# Altium schematic sheet Compute_Module_EXT_INTERFACES.SchDoc: STM32F446 CNC
size C; Author: AM; CompanyName: Expatria Technologies; DrawnBy: A.Marles; Engineer: AM; Organization: Expatria Technolgoies; Address1: 1136 Glade Court; Address3: Port Coquitlam, BC V3B 1R5; Address4: Canada; DocumentNumber: 8; SheetNumber: 8; SheetTotal: 30
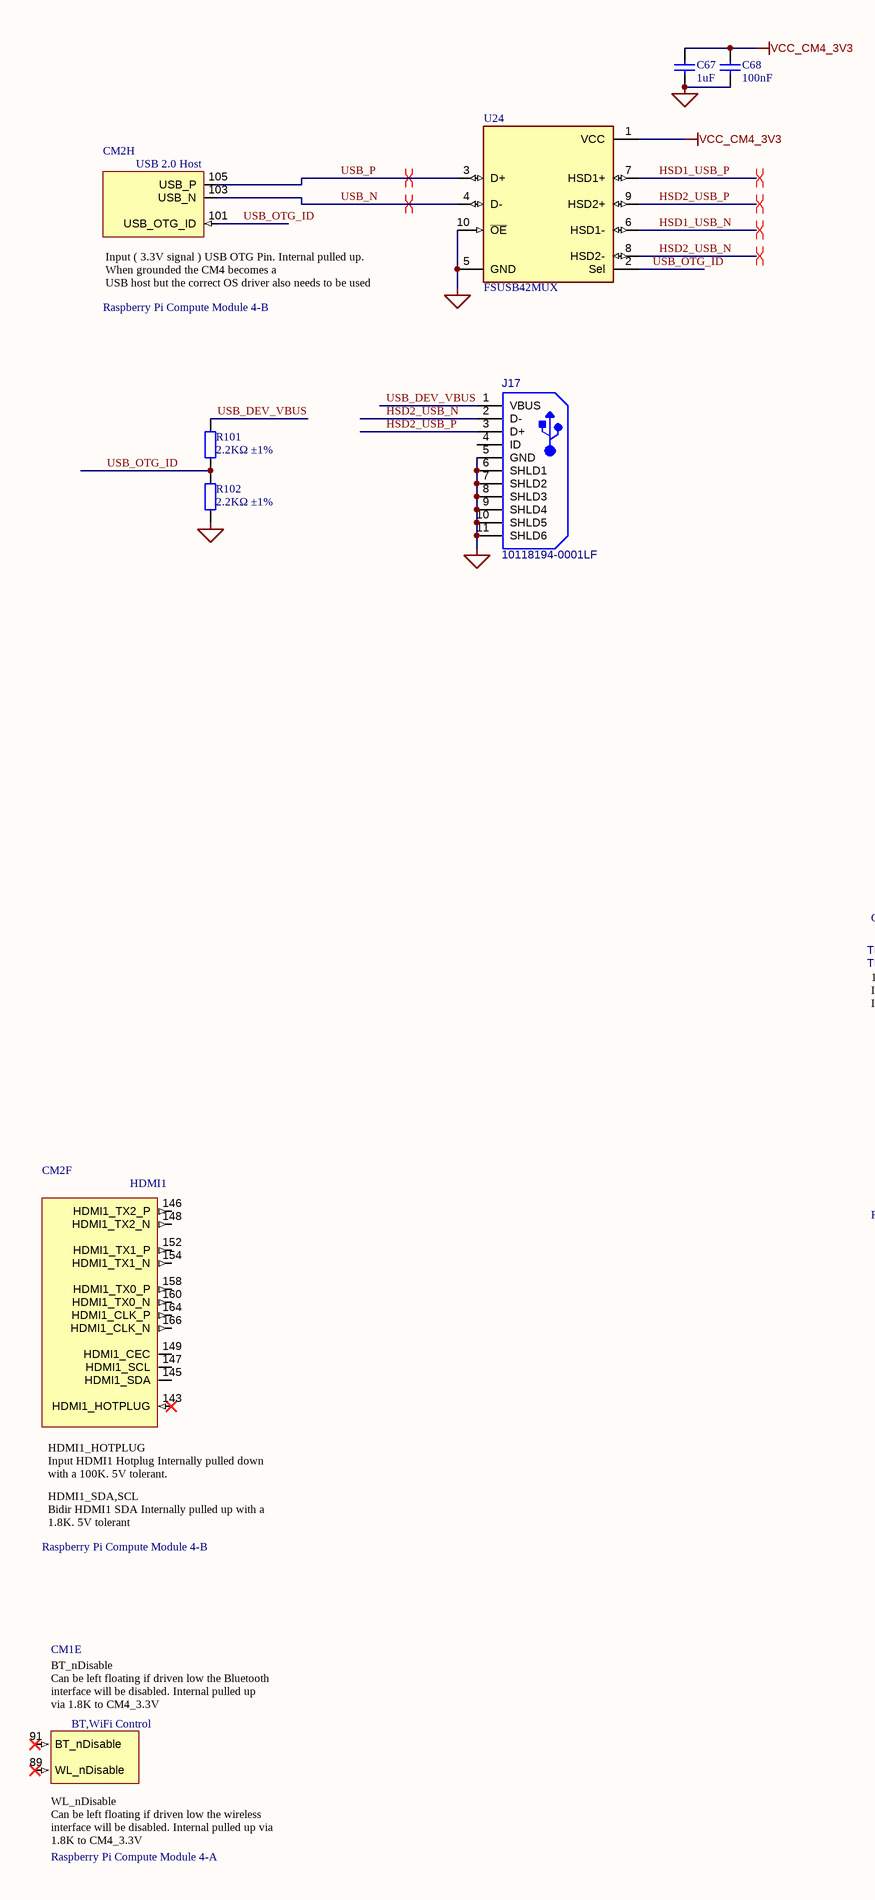
[diagram p0: Compute_Module_EXT_INTERFACES.SchDoc, left]
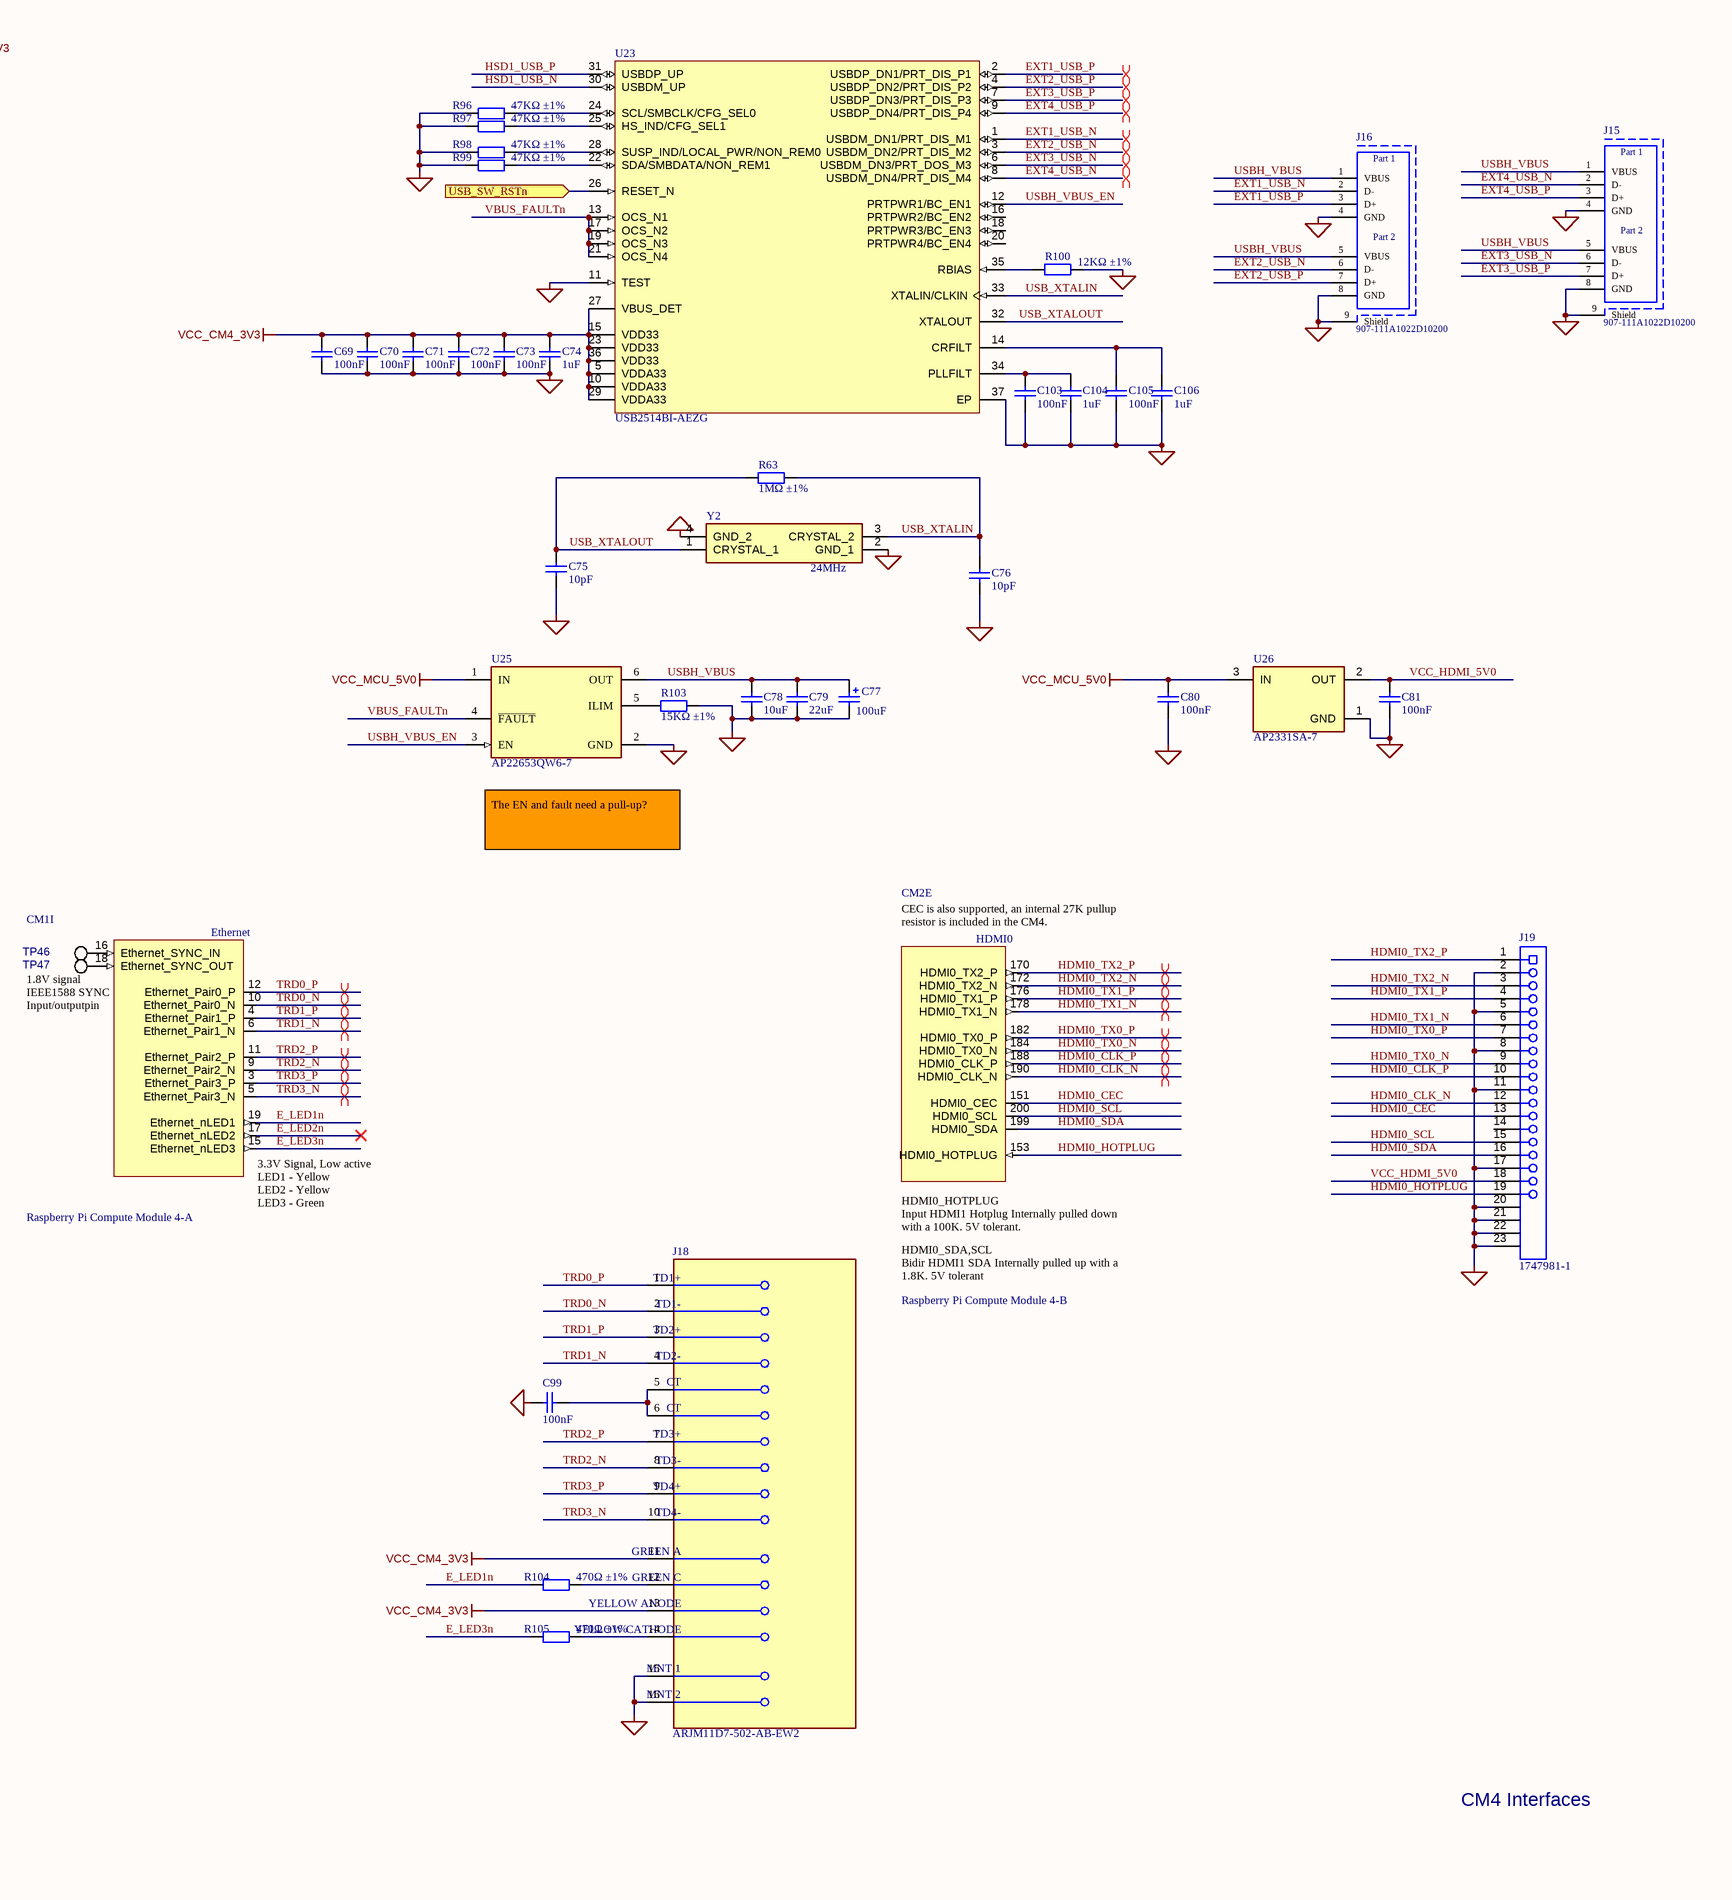
[diagram p1: Compute_Module_EXT_INTERFACES.SchDoc, right]

## Parts
C67  1uF  [0603_C]
C68  100nF  [0603_C]
C69  100nF  [0603_C]
C70  100nF  [0603_C]
C71  100nF  [0603_C]
C72  100nF  [0603_C]
C73  100nF  [0603_C]
C74  1uF  [0603_C]
C75  10pF  [0603_C]
C76  10pF  [0603_C]
C77  100uF  [WCAP-ASLI_D6.3H7.7]
C78  10uF  [1206_C]
C79  22uF  [0805_C]
C80  100nF  [0603_C]
C81  100nF  [0603_C]
C99  100nF  [0603_C]
C103  100nF  [0603_C]
C104  1uF  [0603_C]
C105  100nF  [0603_C]
C106  1uF  [0603_C]
CM1  Raspberry Pi Compute Module 4-A  [DF40HC30100DS04V51]  (parts E,I of 14)
CM2  Raspberry Pi Compute Module 4-B  [DF40HC30100DS04V51 - p101-200]  (parts E,F,H of 10)
J15  907-111A1022D10200  [USB-A-TH_USB-M-51]
J16  907-111A1022D10200  [USB-A-TH_USB-M-51]
J17  10118194-0001LF  [FCI-10118194-0001LF-5_V]
J18  ARJM11D7-502-AB-EW2  [FP-ARJM11D7-502-AB-EW2-MFG]
J19  1747981-1  [TE-1747981-1_V]
R63  1MΩ ±1%  [0402_R]
R96  47KΩ ±1%  [0402_R]
R97  47KΩ ±1%  [0402_R]
R98  47KΩ ±1%  [0402_R]
R99  47KΩ ±1%  [0402_R]
R100  12KΩ ±1%  [0402_R]
R101  2.2KΩ ±1%  [0402_R]
R102  2.2KΩ ±1%  [0402_R]
R103  15KΩ ±1%  [0402_R]
R104  470Ω ±1%  [0402_R]
R105  470Ω ±1%  [0402_R]
TP46  TESTPOINT  [TP/SMALL]  (value not drawn)  (no BOM)
TP47  TESTPOINT  [TP/SMALL]  (value not drawn)  (no BOM)
U23  USB2514BI-AEZG  [QFN50P600X600X100-37N-D]
U24  FSUSB42MUX  [SOP50P490X110-10N]
U25  AP22653QW6-7  [SOT95P280X145-6N]
U26  AP2331SA-7  [SOT91P240X120-3N]
Y2  value 24MHz  [YSX321SL]  (hidden comment: 24.0 MHz)

## Ports
USB_SW_RSTn (in)

## Nets
MCU_GND: C67.1 C68.1 C69.1 C70.1 C71.1 C72.1 C73.1 C74.1 C75.1 C76.1 C77.2(N) C78.1 C79.1 C80.1 C81.1 C99.2 C103.1 C104.1 C105.1 C106.1 J15.4(GND) J15.8(GND) J15.9(Shield) J16.4(GND) J16.8(GND) J16.9(Shield) J17.5(GND) J17.6(SHLD1) J17.7(SHLD2) J17.8(SHLD3) J17.9(SHLD4) J17.10(SHLD5) J17.11(SHLD6) J18.15(MNT_1) J18.16(MNT_2) J19.2 J19.5 J19.8 J19.11 J19.17 J19.20(SHLD1) J19.21(SHLD2) J19.22(SHLD3) J19.23(SHLD4) R96.2 R97.2 R98.2 R99.2 R100.2 R102.1 R103.2 U23.11(TEST) U23.37(EP) U24.5(GND) U24.10(~{OE}) U25.2(GND) U26.1(GND) Y2.2(GND_1) Y2.4(GND_2)
VCC_CM4_3V3: C67.2 C68.2 C69.2 C70.2 C71.2 C72.2 C73.2 C74.2 J18.11(GREEN_A) J18.13(YELLOW_ANODE) U23.5(VDDA33) U23.10(VDDA33) U23.15(VDD33) U23.23(VDD33) U23.27(VBUS_DET) U23.29(VDDA33) U23.36(VDD33) U24.1(VCC)
VCC_MCU_5V0: C80.2 U25.1(IN) U26.3(IN)
E_LED1n: CM1.19(Ethernet_nLED1) R104.1
E_LED2n: CM1.17(Ethernet_nLED2)
E_LED3n: CM1.15(Ethernet_nLED3) R105.1
EXT1_USB_N: J16.2(D-) U23.1(USBDM_DN1/PRT_DIS_M1)
EXT1_USB_P: J16.3(D+) U23.2(USBDP_DN1/PRT_DIS_P1)
EXT2_USB_N: J16.6(D-) U23.3(USBDM_DN2/PRT_DIS_M2)
EXT2_USB_P: J16.7(D+) U23.4(USBDP_DN2/PRT_DIS_P2)
EXT3_USB_N: J15.6(D-) U23.6(USBDM_DN3/PRT_DOS_M3)
EXT3_USB_P: J15.7(D+) U23.7(USBDP_DN3/PRT_DIS_P3)
EXT4_USB_N: J15.2(D-) U23.8(USBDM_DN4/PRT_DIS_M4)
EXT4_USB_P: J15.3(D+) U23.9(USBDP_DN4/PRT_DIS_P4)
HDMI0_CEC: CM2.151(HDMI0_CEC) J19.13
HDMI0_CLK_N: CM2.190(HDMI0_CLK_N) J19.12
HDMI0_CLK_P: CM2.188(HDMI0_CLK_P) J19.10
HDMI0_HOTPLUG: CM2.153(HDMI0_HOTPLUG) J19.19
HDMI0_SCL: CM2.200(HDMI0_SCL) J19.15
HDMI0_SDA: CM2.199(HDMI0_SDA) J19.16
HDMI0_TX0_N: CM2.184(HDMI0_TX0_N) J19.9
HDMI0_TX0_P: CM2.182(HDMI0_TX0_P) J19.7
HDMI0_TX1_N: CM2.178(HDMI0_TX1_N) J19.6
HDMI0_TX1_P: CM2.176(HDMI0_TX1_P) J19.4
HDMI0_TX2_N: CM2.172(HDMI0_TX2_N) J19.3
HDMI0_TX2_P: CM2.170(HDMI0_TX2_P) J19.1
HSD1_USB_N: U23.30(USBDM_UP) U24.6(HSD1-)
HSD1_USB_P: U23.31(USBDP_UP) U24.7(HSD1+)
HSD2_USB_N: J17.2(D-) U24.8(HSD2-)
HSD2_USB_P: J17.3(D+) U24.9(HSD2+)
TRD0_N: CM1.10(Ethernet_Pair0_N) J18.2(TD1-)
TRD0_P: CM1.12(Ethernet_Pair0_P) J18.1(TD1+)
TRD1_N: CM1.6(Ethernet_Pair1_N) J18.4(TD2-)
TRD1_P: CM1.4(Ethernet_Pair1_P) J18.3(TD2+)
TRD2_N: CM1.9(Ethernet_Pair2_N) J18.8(TD3-)
TRD2_P: CM1.11(Ethernet_Pair2_P) J18.7(TD3+)
TRD3_N: CM1.5(Ethernet_Pair3_N) J18.10(TD4-)
TRD3_P: CM1.3(Ethernet_Pair3_P) J18.9(TD4+)
USB_DEV_VBUS: J17.1(VBUS) R101.2
USB_N: CM2.103(USB_N) U24.4(D-)
USB_OTG_ID: CM2.101(USB_OTG_ID) R101.1 R102.2 U24.2(Sel)
USB_P: CM2.105(USB_P) U24.3(D+)
USB_SW_RSTn: U23.26(RESET_N) ; port USB_SW_RSTn
USB_XTALIN: C76.2 R63.2 U23.33(XTALIN/CLKIN) Y2.3(CRYSTAL_2)
USB_XTALOUT: C75.2 R63.1 U23.32(XTALOUT) Y2.1(CRYSTAL_1)
USBH_VBUS: C77.1(P) C78.2 C79.2 J15.1(VBUS) J15.5(VBUS) J16.1(VBUS) J16.5(VBUS) U25.6(OUT)
USBH_VBUS_EN: U23.12(PRTPWR1/BC_EN1) U25.3(EN)
VBUS_FAULTn: U23.13(OCS_N1) U23.17(OCS_N2) U23.19(OCS_N3) U23.21(OCS_N4) U25.4(~{FAULT})
VCC_HDMI_5V0: C81.2 J19.18 U26.2(OUT)
NetC99_1: C99.1 J18.5(CT) J18.6(CT)
NetC103_2: C103.2 C104.2 U23.34(PLLFILT)
NetC105_2: C105.2 C106.2 U23.14(CRFILT)
NetCM1_16: CM1.16(Ethernet_SYNC_IN) TP46.1
NetCM1_18: CM1.18(Ethernet_SYNC_OUT) TP47.1
NetJ18_12: J18.12(GREEN_C) R104.2
NetJ18_14: J18.14(YELLOW_CATHODE) R105.2
NetR96_1: R96.1 U23.24(SCL/SMBCLK/CFG_SEL0)
NetR97_1: R97.1 U23.25(HS_IND/CFG_SEL1)
NetR98_1: R98.1 U23.28(SUSP_IND/LOCAL_PWR/NON_REM0)
NetR99_1: R99.1 U23.22(SDA/SMBDATA/NON_REM1)
NetR100_1: R100.1 U23.35(RBIAS)
NetR103_1: R103.1 U25.5(ILIM)

Not connected (* = marked no-connect by the designer): CM1 89(WL_nDisable)* 91(BT_nDisable)*; CM2 143(HDMI1_HOTPLUG)* 145(HDMI1_SDA) 146(HDMI1_TX2_P) 147(HDMI1_SCL) 148(HDMI1_TX2_N) 149(HDMI1_CEC) 152(HDMI1_TX1_P) 154(HDMI1_TX1_N) 158(HDMI1_TX0_P) 160(HDMI1_TX0_N) 164(HDMI1_CLK_P) 166(HDMI1_CLK_N); J17 4(ID); J19 14; U23 16(PRTPWR2/BC_EN2) 18(PRTPWR3/BC_EN3) 20(PRTPWR4/BC_EN4)

## Layout directives
differential pair: EXT1_USB_N, EXT1_USB_P, EXT2_USB_N, EXT2_USB_P, EXT3_USB_N, EXT3_USB_P, EXT4_USB_N, EXT4_USB_P, HDMI0_CLK_N, HDMI0_CLK_P, HDMI0_TX0_N, HDMI0_TX0_P, HDMI0_TX1_N, HDMI0_TX1_P, HDMI0_TX2_N, HDMI0_TX2_P, HSD1_USB_N, HSD1_USB_P, HSD2_USB_N, HSD2_USB_P, TRD0_N, TRD0_P, TRD1_N, TRD1_P, TRD2_N, TRD2_P, TRD3_N, TRD3_P, USB_N, USB_P

## Notes on the sheet
- (near U25) The EN and fault need a pull-up?
- CM4 Interfaces
- SHEET
- PROJECT
- REV
- Expatria Technologies
- 1136 Glade Court
- Port Coquitlam, BC V3B 1R5
- PHONE: (778) 238-9336
- EMAIL: info@expatria.ca
- SIZE
- ENGR
- C
- MODIFIED
- DOCUMENT
- /
- Copyright Expatria Technologies 2022. This document describes Open Hardware and is licensed under the CERN-OHL-S v2. No warranty is implied or expressed.
- (in symbol 907-111A1022D10200) Part 1; Part 2
- (in symbol CM4_Module_A, part E) BT_nDisable / Can be left floating if driven low the Bluetooth interface will be disabled. Internal pulled up / via 1.8K to CM4_3.3V; BT,WiFi Control; WL_nDisable / Can be left floating if driven low the wireless interface will be disabled. Internal pulled up via / 1.8K to CM4_3.3V
- (in symbol CM4_Module_A, part I) Ethernet; 1.8V signal / IEEE1588 SYNC Input/outputpin; by Amornthep Phunsin; 3.3V Signal, Low active / LED1 - Yellow / LED2 - Yellow / LED3 - Green
- (in symbol CM4_Module_B, part E) HDMI0; CEC is also supported, an internal 27K pullup resistor is included in the CM4.; HDMI0_HOTPLUG / Input HDMI1 Hotplug Internally pulled down with a 100K. 5V tolerant.; HDMI0_SDA,SCL / Bidir HDMI1 SDA Internally pulled up with a 1.8K. 5V tolerant
- (in symbol CM4_Module_B, part F) HDMI1; HDMI1_HOTPLUG / Input HDMI1 Hotplug Internally pulled down with a 100K. 5V tolerant.; HDMI1_SDA,SCL / Bidir HDMI1 SDA Internally pulled up with a 1.8K. 5V tolerant
- (in symbol CM4_Module_B, part H) USB 2.0 Host; Input ( 3.3V signal ) USB OTG Pin. Internal pulled up. When grounded the CM4 becomes a / USB host but the correct OS driver also needs to be used

## Library data of the parts
C67 C74 C104 C106 = 0603 1uF (105) 10% 50V: Chip capacitors; Manufacturer: Samsung Electro-Mechanics; Manufacturer Part Number: CL10A105KB8NNNC; Tolerance: 10%; Voltage: 50V; ComponentLink1Description: Supplier link; ComponentLink1URL: http://www.szlcsc.com/product/details_16531.html; Package: 0603; Supplier: LCSC; SuppliersPartNumber: C15849; Capacitance: 1uF
C68-C73 C80 C81 C99 C103 C105 = 0603 100nF (104) 10% 50V: Chip capacitors; Manufacturer: YAGEO; Manufacturer Part Number: CC0603KRX7R9BB104; Tolerance: 10%; Voltage: 50V; ComponentLink1Description: Supplier link; ComponentLink1URL: http://www.szlcsc.com/product/details_15331.html; Package: 0603; Supplier: LCSC; SuppliersPartNumber: C14663; Capacitance: 100nF
C75 C76 = 0603 10pF (100) 5% 50V: Chip capacitors; Manufacturer: Samsung Electro-Mechanics; PartNumber: CL10C100JB8NNNC; Tolerance: 5%; Voltage: 50V; ComponentLink1Description: Supplier link; ComponentLink1URL: http://www.szlcsc.com/product/details_1986.html; Package: 0603; Supplier: LCSC; SuppliersPartNumber: C1634; Capacitance: 10pF; Manufacturer Part Number: CL10C100JB8NNNC
C77 = 865080445010: -45℃~+105℃ 2000hrs@105℃ 100uF 7.7mm 35V 6.3mm ±20% SMD,6.3x7.7mm Aluminum Electrolytic Capacitors - SMD ROHS; Manufacturer: Capxon International Elec; Manufacturer Part Number: HV101M035E077ETR; SuppliersPartNumber: C59934; Value: 100uF; Supplier: LCSC
C78 = 1206 10uF (106) 10% 50V: Chip capacitors; Manufacturer: Samsung Electro-Mechanics; Manufacturer Part Number: CL31A106KBHNNNE; Tolerance: 10%; Voltage: 50V; ComponentLink1Description: Supplier link; ComponentLink1URL: http://www.szlcsc.com/product/details_14236.html; Package: 1206; Supplier: LCSC; SuppliersPartNumber: C13585; Capacitance: 10uF; Manufacturer 1: Samsung Electro-Mechanics
C79 = 0805 22uF (226) 20% 25V: Chip capacitors; Manufacturer: Samsung Electro-Mechanics; PartNumber: CL21A226MAQNNNE; Tolerance: 20%; Voltage: 25V; ComponentLink1Description: Supplier link; ComponentLink1URL: http://www.szlcsc.com/product/details_46786.html; Package: 0805; Supplier: LCSC; SuppliersPartNumber: C45783; Capacitance: 22uF; Manufacturer Part Number: CL21A226MAQNNNE
CM1 = CM4_Module_A: Raspberry Pi Compute Module 4 Pins 1-100 (Connector A); Manufacturer: Hirose; Manufacturer Part Number: DF40HC(3.0)-100DS-0.4V(51); SuppliersPartNumber: C424649; Supplier: LCSC; Value: CM4_Module_A
CM2 = CM4_Module_B: Raspberry Pi Compute Module 4 Pins 101-200 (Connector B); Manufacturer: Hirose; Manufacturer Part Number: DF40HC(3.0)-100DS-0.4V(51); SuppliersPartNumber: C424649; Supplier: LCSC; Value: CM4_Module_B
J15 J16 = 907-111A1022D10200: USB 2.0 2 8 Female Type-A Plugin USB Connectors ROHS; Manufacturer: Jing Extension of the Electronic Co.; SuppliersPartNumber: C12049; Supplier 1: LCSC; Supplier Part Number 1: C12049; Manufacturer Part Number: 907-111A1022D10200; RoHS: No; Supplier: LCSC
J17 = USB-5-6SHLD: CONN RCPT USB2.0 MICRO B SMD R/A; Manufacturer 1: Amphenol ICC (FCI); Connector Type: Receptacle,USB; Manufacturer Part Number 1: 10118194-0001LF; Supplier: LCSC; Supplier Part Number 1: C132563; Manufacturer Part Number: 10118194-0001LF; SuppliersPartNumber: C132563; Value: 10118194-0001LF; Manufacturer: Amphenol ICC (FCI)
J18 = ARJM11D7-502-AB-EW2: 1 Port RJ45Through Hole 10/100/1000 Base-T, AutoMDIX; Manufacturer: Abracon LLC; Number of Ports: 1; Connector Type: RJ45; Shielding: Shielded; Direction: Up; Number of Cores per Jack: 8; Value: ARJM11D7-502-AB-EW2; SuppliersPartNumber: 535-14152-ND; Supplier: Digi-Key; Manufacturer Part Number: ARJM11D7-502-AB-EW2; Max Operating Temperature: 85°C; Min Operating Temperature: -40°C; Contact Plating: Gold; RoHS Compliant: Yes; Termination: Solder; Mount: Through Hole; Color: Green; Number of Rows: 1; Packaging: Tray
J19 = CMP-1684-00008-1: HDMI Receptacle, Pitch 0.5 mm, 19 Position, Height 6.38 mm, RoHS, Tape and Reel; Manufacturer: TE Connectivity; Power Rating: 100 mW; Tolerance: 1%; Resistance: 3.6 kohm; Voltage Rating: 50 V; Packaging: Tape and Reel; Max Operating Temperature: 155degC; RoHSCompliant: True; Case/Package: 0603; Mount: Surface Mount; ComponentLink2URL: http://www.te.com/commerce/DocumentDelivery/DDEController?Action=showdoc&DocId=Customer+Drawing%7F1747981%7FF5%7Fpdf%7FEnglish%7FENG_CD_1747981_F5.pdf%7F1747981-1; Length: 1.6 mm; ComponentLink2Description: Datasheet; ComponentLink1Description: Manufacturer URL; PackageReference: 1747981-1; Package Quantity: 5000; Min Operating Temperature: -55degC; ComponentLink1URL: http://www.te.com/; REACH SVHC: Unknown; Case Code (Imperial): 0603; Height: 0.45 mm; Width: 0.8 mm; DatasheetVersion: Rev. F5, 12/2015; PackageDescription: HDMI Receptacle, Pitch 0.5 mm, 19 Position, Height 6.38 mm; Case Code (Metric): 1608; SuppliersPartNumber: C428484; Supplier: LCSC; Manufacturer Part Number: 1747981-1
R63 = 0402 1M (1004) 1%: Chip resistor; Manufacturer: Uniroyal Elec; PartNumber: 0402WGF1004TCE; Power: 1/16W; ComponentLink1Description: Supplier link; ComponentLink1URL: http://www.szlcsc.com/product/details_26826.html; Package: 0402; Supplier: LC; SuppliersPartNumber: C26083; Resistance: 1MΩ; Tolerance: 1%
R96-R99 = 0402 47K (4702) 1%: Chip resistor; Manufacturer: Uniroyal Elec; PartNumber: 0402WGF4702TCE; Power: 1/16W; ComponentLink1Description: Supplier link; ComponentLink1URL: http://www.szlcsc.com/product/details_26535.html; Package: 0402; Supplier: LCSC; SuppliersPartNumber: C25792; Resistance: 47KΩ; Tolerance: 1%; Manufacturer Part Number: 0402WGF4702TCE
R100 = 0402 12K (1202) 1%: Chip resistor; Manufacturer: Uniroyal Elec; PartNumber: 0402WGF1202TCE; Power: 1/16W; ComponentLink1Description: Supplier link; ComponentLink1URL: http://www.szlcsc.com/product/details_26495.html; Package: 0402; Supplier: LCSC; SuppliersPartNumber: C25752; Resistance: 12KΩ; Tolerance: 1%; Manufacturer Part Number: 0402WGF1202TCE
R101 R102 = 0402 2.2K (2201) 1%: Chip resistor; Manufacturer: Uniroyal Elec; PartNumber: 0402WGF2201TCE; Power: 1/16W; ComponentLink1Description: Supplier link; ComponentLink1URL: http://www.szlcsc.com/product/details_26622.html; Package: 0402; Supplier: LCSC; SuppliersPartNumber: C25879; Resistance: 2.2KΩ; Tolerance: 1%; Manufacturer Part Number: 0402WGF2201TCE
R103 = 0402 15K (1502) 1%: Chip resistor; Manufacturer: Uniroyal Elec; PartNumber: 0402WGF1502TCE; Power: 1/16W; ComponentLink1Description: Supplier link; ComponentLink1URL: http://www.szlcsc.com/product/details_26499.html; Package: 0402; Supplier: LCSC; SuppliersPartNumber: C25756; Resistance: 15KΩ; Tolerance: 1%; Manufacturer Part Number: 0402WGF1502TCE
R104 R105 = 0402 470R (4700) 1%: Chip resistor; Manufacturer: Uniroyal Elec; PartNumber: 0402WGF4700TCE; Power: 1/16W; ComponentLink1Description: Supplier link; ComponentLink1URL: http://www.szlcsc.com/product/details_25860.html; Package: 0402; Supplier: LCSC; SuppliersPartNumber: C25117; Resistance: 470Ω; Tolerance: 1%; Manufacturer Part Number: 0402WGF4700TCE
TP46 TP47 = TESTPOINT: Test Point; Manufacturer 1: N/A; Manufacturer Part Number 1: N/A; Value: Testpoint
U23 = USB2514BI-AEZG: Microchip USB2514BI-AEZG; USB Controller; 480Mbit/s; USB 2.0; 3.3 V; 36-Pin QFN; Current - Supply: 85mA; Standards: USB2.0; Auxiliary Sense: -40degC~85degC; Other Names: Q5138631 / Q5487824 / Q7033177 / USB2514BIAEZG; Voltage - Supply: 3V~3.6V; Dynamic Catalog: USBControllers; Function: HubController; Operating Supply Voltage: 3.3V; Data Rate: 480Mbps; Min Supply Voltage: 3V; Max Supply Voltage: 3.6V; Number of Ports: 4; Number of Transceivers: 1; ESD Protection: Yes; Family: Interface-Controllers; Datasheet Version: Rev. 2.2, 02/2012; Quantity Available: Tube; Type: USB; Supplier Device Package: 36-QFN-EP(6x6); Operating Temperature: -40degC~85degC; Manufacturer URL: http://www.microchip.com/; Packaging: Tube; Interface: USB; Protocol: USB; Package / Case: 36-TQFNExposedPad; Datasheet URL: https://datasheet.ciiva.com/22650/1691496-22650784.pdf; Standard Package: 490; Minimum Quantity: USB; Category: IntegratedCircuits(ICs); Manufacturer: Microchip; Internal Switch(s): 3V~3.6V; Manufacturer Part Number: USB2514BI-AEZG; Supplier 1: LCSC; Supplier Part Number 1: C633339; RoHS: Yes; Mount: Surface Mount; Case/Package: QFN; Number of Pins: 36; Contact Plating: Tin,Matte; Min Operating Temperature: -40°C; Max Operating Temperature: 85°C; Package Quantity: 490; Series: -; Operating Supply Current: 85mA; Length: 6.15mm; Width: 6.15mm; Height: 0.95mm; Radiation Hardening: No; Lead Free: Lead Free; RoHS Compliant: Yes; Reach SVHC Compliant: Yes; ComponentLink1URL: https://datasheet.ciiva.com/22650/1691496-22650784.pdf?src-supplier=Element14; ComponentLink1Description: https://datasheet.ciiva.com/22650/1691496-22650784.pdf?src-supplier=Element14; SuppliersPartNumber: C633339; Supplier: LCSC
U24 = FSUSB42MUX: FSUSB42 Series DPDT 4.3 V 480 Mbps SMT Hi Speed USB 2.0 Switch - MSOP-10; Manufacturer: ON Semiconductor / Fairchild; Voltage: 4.3V; Current: 100mA; Number of Inputs: 2; Supply Type: Single; Number of Outputs: 4; On-State Resistance: 6.5R; Min Supply Voltage: 3V; -3db Bandwidth: 720MHz; Package Quantity: 1; Length: 3mm; Radiation Hardening: No; Number of Pins: 10; Width: 3mm; Number of Channels: 2; REACH SVHC: No SVHC; Lead Free: Lead Free; Max Operating Temperature: 85°C; Min Operating Temperature: -40°C; Packaging: Tape and Reel; Throw Configuration: DPDT; Operating Supply Voltage: 4.3V; Max Supply Voltage: 4.3V; Data Rate: 480Mbps; Mount: Surface Mount; Case/Package: MSOP; Weight: 0.1125g; Height: 0.85mm; Manufacturer Part Number: FSUSB42MUX; Supplier 1: LCSC; Supplier Part Number 1: C11355; RoHS: Yes; Category: Interface ICs; Stock 1: 2967; Pricing 1: 1=0.493200, 10=0.493200, 30=0.463000, 32=0.458400, 34=0.458400, 36=0.458400 (AUD); Series: -; Reach SVHC Compliant: Yes; RoHS Compliant: Yes; ComponentLink1URL: https://datasheet.ciiva.com/1666/fsusb42-1666347.pdf?src-supplier=Digi-Key; ComponentLink1Description: https://datasheet.ciiva.com/1666/fsusb42-1666347.pdf?src-supplier=Digi-Key; ComponentLink2URL: https://datasheet.ciiva.com/1666/fsusb42-1666348.pdf?src-supplier=Digi-Key; ComponentLink2Description: https://datasheet.ciiva.com/1666/fsusb42-1666348.pdf?src-supplier=Digi-Key; ComponentLink3URL: https://datasheet.ciiva.com/1666/fsusb42-1666349.pdf?src-supplier=Digi-Key; ComponentLink3Description: https://datasheet.ciiva.com/1666/fsusb42-1666349.pdf?src-supplier=Digi-Key; ComponentLink4URL: https://datasheet.ciiva.com/3232/fsusb42-3232662.pdf?src-supplier=Avnet; ComponentLink4Description: https://datasheet.ciiva.com/3232/fsusb42-3232662.pdf?src-supplier=Avnet; ComponentLink5URL: https://datasheet.ciiva.com/3233/fsusb42-3233258.pdf?src-supplier=Avnet; ComponentLink5Description: https://datasheet.ciiva.com/3233/fsusb42-3233258.pdf?src-supplier=Avnet; ComponentLink6URL: https://datasheet.ciiva.com/4924/fsusb42-112719-4924269.pdf?src-supplier=Mouser; ComponentLink6Description: https://datasheet.ciiva.com/4924/fsusb42-112719-4924269.pdf?src-supplier=Mouser; Supplier: LCSC; SuppliersPartNumber: C11355
U25 = AP22653QW6-7: ESDA Series 14.2 V 90 pF Automotive Dual Transil ESD Array - SOT-23; Manufacturer: Diodes; Direction: Unidirectional,Bidirectional; Capacitance: 90pF; Number of Unidirectional Channels: 2; Reverse Standoff Voltage: 12V; Min Breakdown Voltage: 14.2V; Clamping Voltage: 21V; Peak Pulse Power: 300W; Power Line Protection: No; Leakage Current: 5uA; Operating Supply Voltage: 1.25V; Peak Pulse Current: 14A; Diode Type: ZENER; Manufacturer Part Number: AP22653QW6-7; Supplier 1: LCSC; Supplier Part Number 1: C5157828; RoHS: Yes; Category: TVS Diodes; Mount: Surface Mount; Number of Pins: 3; Min Operating Temperature: -40°C; Max Operating Temperature: 150°C; Packaging: Tape and Reel; Package Quantity: 3000; Working Voltage: 12V; Element Configuration: Dual; Resistor Type: Zener; Series: Automotive, AEC-Q101, ESDAY, TRANSIL™; Length: 2.9mm; Depth: 1.3mm; Radiation Hardening: No; Reach SVHC Compliant: Yes; RoHS Compliant: Yes; ComponentLink1URL: https://datasheet.ciiva.com/6574/dm00035279-6574399.pdf?src-supplier=Digi-Key; ComponentLink1Description: https://datasheet.ciiva.com/6574/dm00035279-6574399.pdf?src-supplier=Digi-Key; ComponentLink2URL: https://datasheet.ciiva.com/6574/dm00035279-6574410.pdf?src-supplier=Digi-Key; ComponentLink2Description: https://datasheet.ciiva.com/6574/dm00035279-6574410.pdf?src-supplier=Digi-Key; ComponentLink3URL: https://datasheet.ciiva.com/15186/getdatasheetpartid-491433-15186605.pdf?src-supplier=Verical; ComponentLink3Description: https://datasheet.ciiva.com/15186/getdatasheetpartid-491433-15186605.pdf?src-supplier=Verical; ComponentLink4URL: https://datasheet.ciiva.com/41443/001183987-da-01-en-tvs-diode-12v-2-esda14v2ly-sot-23-3l-stm-41443398.pdf?src-supplier=Conrad; ComponentLink4Description: https://datasheet.ciiva.com/41443/001183987-da-01-en-tvs-diode-12v-2-esda14v2ly-sot-23-3l-stm-41443398.pdf?src-supplier=Conrad; Supplier: LCSC; SuppliersPartNumber: C5157828; Case/Package: SOT-23
U26 = AP2331SA-7: AP2331 Series Single Channel 0.2 A Current-Limited Load Switch - SOT-23; Manufacturer: Diodes; Min Supply Voltage: 2.7V; Turn-On Delay Time: 700us; Output Current: 200mA; Max Supply Voltage: 5.2V; Number of Outputs: 1; On-State Resistance: 350mR; Min Operating Temperature: -40°C; Number of Pins: 3; Max Operating Temperature: 85°C; Height: 1.1mm; Package Quantity: 3000; Radiation Hardening: No; Case/Package: SOT-23; Width: 1.4mm; Mount: Surface Mount; Packaging: Tape and Reel; Length: 3mm; Supplier 1: LCSC; Supplier Part Number 1: C500764; Manufacturer Part Number: AP2331SA-7; RoHS: Yes; Category: Hot Swap Controllers; Weight: 0.00031oz; Max Input Voltage: 5.2V; Min Input Voltage: 2.7V; Series: -; Number of Switches: 1; Lead Free: Lead Free; Reach SVHC Compliant: Yes; RoHS Compliant: Yes; ComponentLink1URL: https://datasheet.ciiva.com/8142/ap2331-8142774.pdf?src-supplier=Avnet; ComponentLink1Description: https://datasheet.ciiva.com/8142/ap2331-8142774.pdf?src-supplier=Avnet; ComponentLink2URL: https://datasheet.ciiva.com/4923/ap2331-6844-4923636.pdf?src-supplier=Mouser; ComponentLink2Description: https://datasheet.ciiva.com/4923/ap2331-6844-4923636.pdf?src-supplier=Mouser; ComponentLink3URL: https://datasheet.ciiva.com/15108/getdatasheetpartid-670771-15108880.pdf?src-supplier=Verical; ComponentLink3Description: https://datasheet.ciiva.com/15108/getdatasheetpartid-670771-15108880.pdf?src-supplier=Verical; ComponentLink4URL: https://datasheet.ciiva.com/1962/ap2331-1962167.pdf?src-supplier=Digi-Key; ComponentLink4Description: https://datasheet.ciiva.com/1962/ap2331-1962167.pdf?src-supplier=Digi-Key; ComponentLink5URL: https://datasheet.ciiva.com/1962/ap2331-1962168.pdf?src-supplier=Digi-Key; ComponentLink5Description: https://datasheet.ciiva.com/1962/ap2331-1962168.pdf?src-supplier=Digi-Key; ComponentLink6URL: https://datasheet.ciiva.com/1962/ap2331-1962169.pdf?src-supplier=Digi-Key; ComponentLink6Description: https://datasheet.ciiva.com/1962/ap2331-1962169.pdf?src-supplier=Digi-Key; SuppliersPartNumber: C500764; Supplier: LCSC
Y2 = S3224000201060: 24MHz SMD Crystal Resonator 20pF 60Ω ±10ppm -40℃~+85℃ SMD3225-4P Crystals ROHS; Manufacturer_Name: JGHC; Manufacturer_Part_Number: S3224000201060; SuppliersPartNumber: C390771; Supplier 1: LCSC; Supplier Part Number 1: C390771; Manufacturer 1: JGHC; Manufacturer Part Number 1: S3224000201060; Manufacturer: JGHC; Manufacturer Part Number: S3224000201060